# Altium schematic sheet DCSource4V3.SchDoc
size A4; DocumentNumber: 1; SheetNumber: 1; SheetTotal: 5
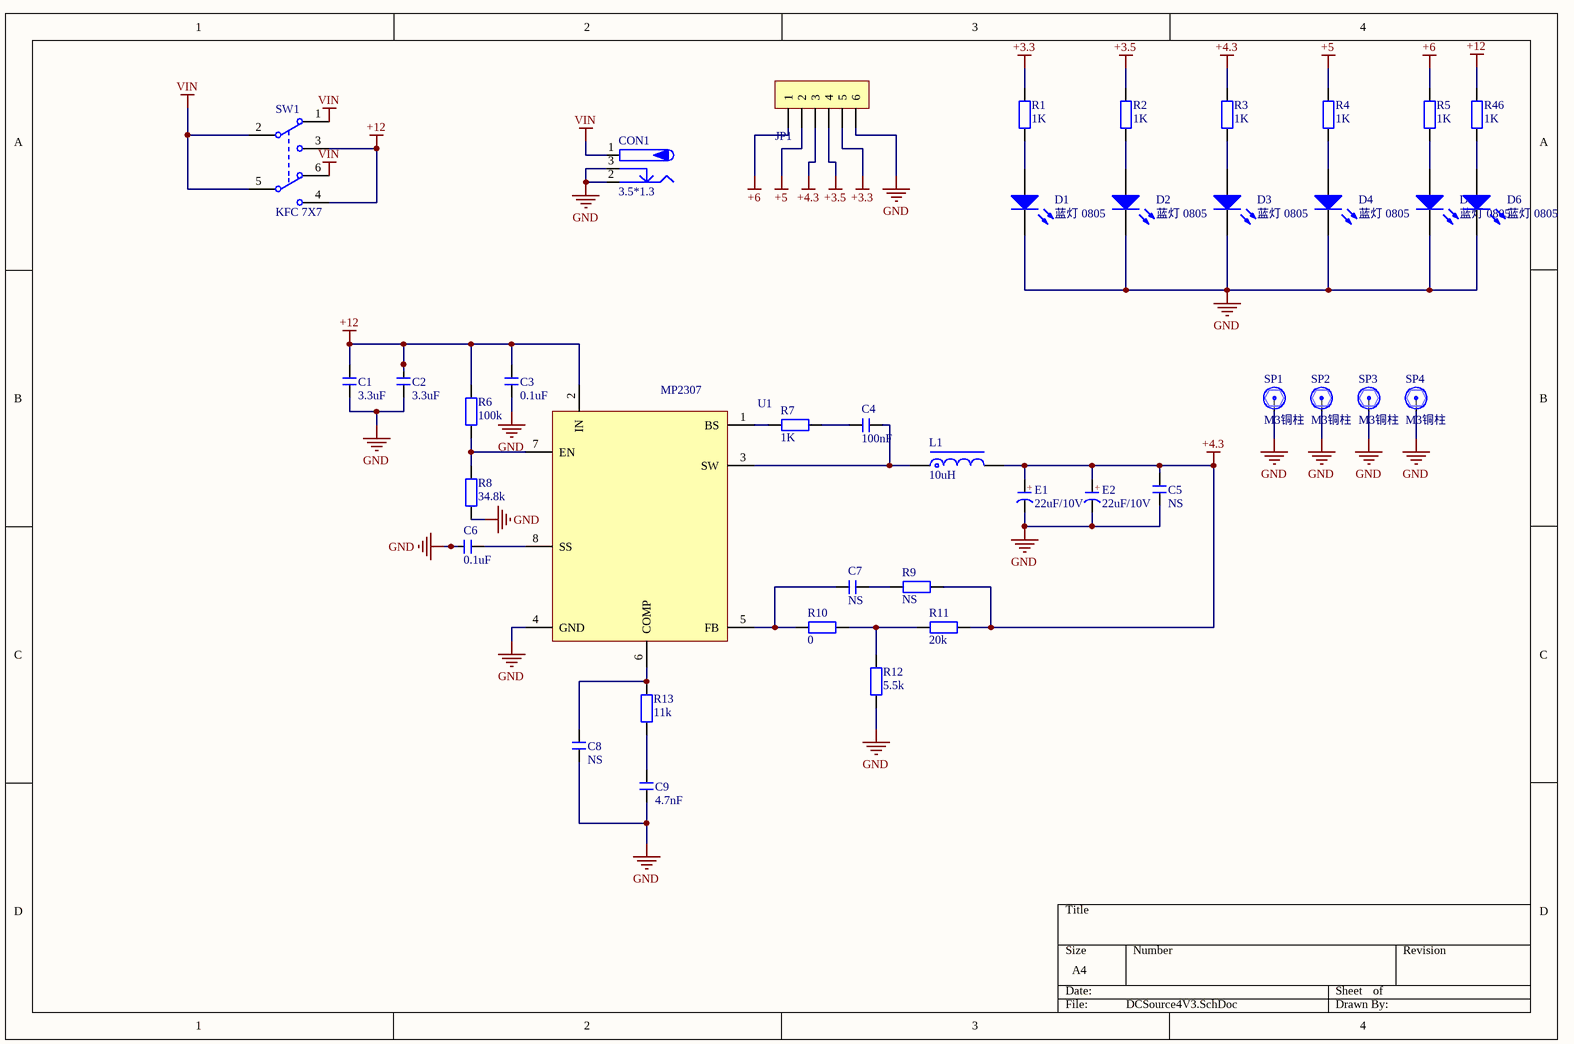
[diagram p0: DCSource4V3.SchDoc]

## Parts
C1  3.3uF  [C 0805_L]
C2  3.3uF  [C 0805_L]
C3  0.1uF  [C 0805_L]
C4  100nF  [C 0805_L]
C5  NS  [C 0805_L]
C6  0.1uF  [C 0805_L]
C7  NS  [C 0805_L]
C8  NS  [C 0805_L]
C9  4.7nF  [C 0805_L]
CON1  3.5*1.3  [DC-005]
D1  蓝灯 0805  [0805_LED_S1]
D2  蓝灯 0805  [0805_LED_S1]
D3  蓝灯 0805  [0805_LED_S1]
D4  蓝灯 0805  [0805_LED_S1]
D5  蓝灯 0805  [0805_LED_S1]
D6  蓝灯 0805  [0805_LED_S1]
E1  22uF/10V  [CT 5*6 - C]
E2  22uF/10V  [CT 5*6 - C]
JP1  HDR-1X6  [XH2.54-WS-6P]  (value not drawn)
L1  10uH  [CD31]
R1  1K  [R 0805_L]
R2  1K  [R 0805_L]
R3  1K  [R 0805_L]
R4  1K  [R 0805_L]
R5  1K  [R 0805_L]
R6  100k  [R 0805_L]
R7  1K  [R 0805_L]
R8  34.8k  [R 0805_L]
R9  NS  [R 0805_L]
R10  0  [R 0805_L]
R11  20k  [R 0805_L]
R12  5.5k  [R 0805_L]
R13  11k  [R 0805_L]
R46  1K  [R 0805_L]
SP1  M3铜柱  [M3x4_L]
SP2  M3铜柱  [M3x4_L]
SP3  M3铜柱  [M3x4_L]
SP4  M3铜柱  [M3x4_L]
SW1  KFC 7X7  [KFC DIP-7X7]
U1  MP2307  [SOP8_M]

## Nets
+3.3: JP1.5 R1.2
+3.5: JP1.4 R2.2
+4.3: C5.2 E1.1(A) E2.1(A) JP1.3 L1.2 R3.2 R9.1 R11.2
+5: JP1.2 R4.2
+6: JP1.1 R5.2
+12: C1.2 C2.2 C3.2 R6.2 R46.2 SW1.3(NO1) SW1.4(NO2) U1.2(IN)
GND: C1.1 C2.1 C3.1 C5.1 C6.2 C8.1 C9.1 CON1.2 CON1.3 D1.K D2.K D3.K D4.K D5.K D6.K E1.2(K) E2.2(K) JP1.6 R8.1 R12.1 SP1.1 SP2.1 SP3.1 SP4.1 U1.4(GND)
VIN: CON1.1 SW1.1(NC1) SW1.2(COM2) SW1.5(COM2) SW1.6(NC2)
NetC4_1: C4.1 R7.2
NetC4_2: C4.2 L1.1 U1.3(SW)
NetC6_1: C6.1 U1.8(SS)
NetC7_1: C7.1 R10.1 U1.5(FB)
NetC7_2: C7.2 R9.2
NetC8_2: C8.2 R13.2 U1.6(COMP)
NetC9_2: C9.2 R13.1
NetD1_A: D1.A R1.1
NetD2_A: D2.A R2.1
NetD3_A: D3.A R3.1
NetD4_A: D4.A R4.1
NetD5_A: D5.A R5.1
NetD6_A: D6.A R46.1
NetR6_1: R6.1 R8.2 U1.7(EN)
NetR7_1: R7.1 U1.1(BS)
NetR10_2: R10.2 R11.1 R12.2

## Notes on the sheet
- (in symbol C-CT) +

## Library data of the parts
C1-C9 = C: 无极性贴片电容; 材质: X7R; BOM名称: 无极性贴片电容
CON1 = P-DC: 低压电源接口; BOM名称: DC电源接口
D1-D6 = 0805 蓝灯: 发光二极管; ComponentLink1Description: 供应商链接; ComponentLink1URL: http://www.szlcsc.com/product/details_2666.html; Package: 0805; Supplier: LC; SuppliersPartNumber: C2293
E1 E2 = C-CT: 贴片固态电容; BOM名称: 贴片固态电容
JP1 = Header 6: 6P接插件; BOM名称: 6P接插件
L1 = L-CD: 贴片功率电感; BOM名称: 功率电感
R1-R13 R46 = R: 贴片电阻; BOM名称: 贴片电阻
SP1-SP4 = 铜柱小焊盘: 铜柱; BOM名称: 铜柱
SW1 = KFC 7X7: 7*7自锁开关; BOM名称: 7*7自锁开关
U1 = Component_1